# EasyEDA schematic Sheet_1(1)_ 09.12.2023.json
TITLE: Sheet_1; REV: 1.0; Date: 2023-06-13; Sheet: 1/1; Drawn By: venkatakrishnanr; Company: Your Company
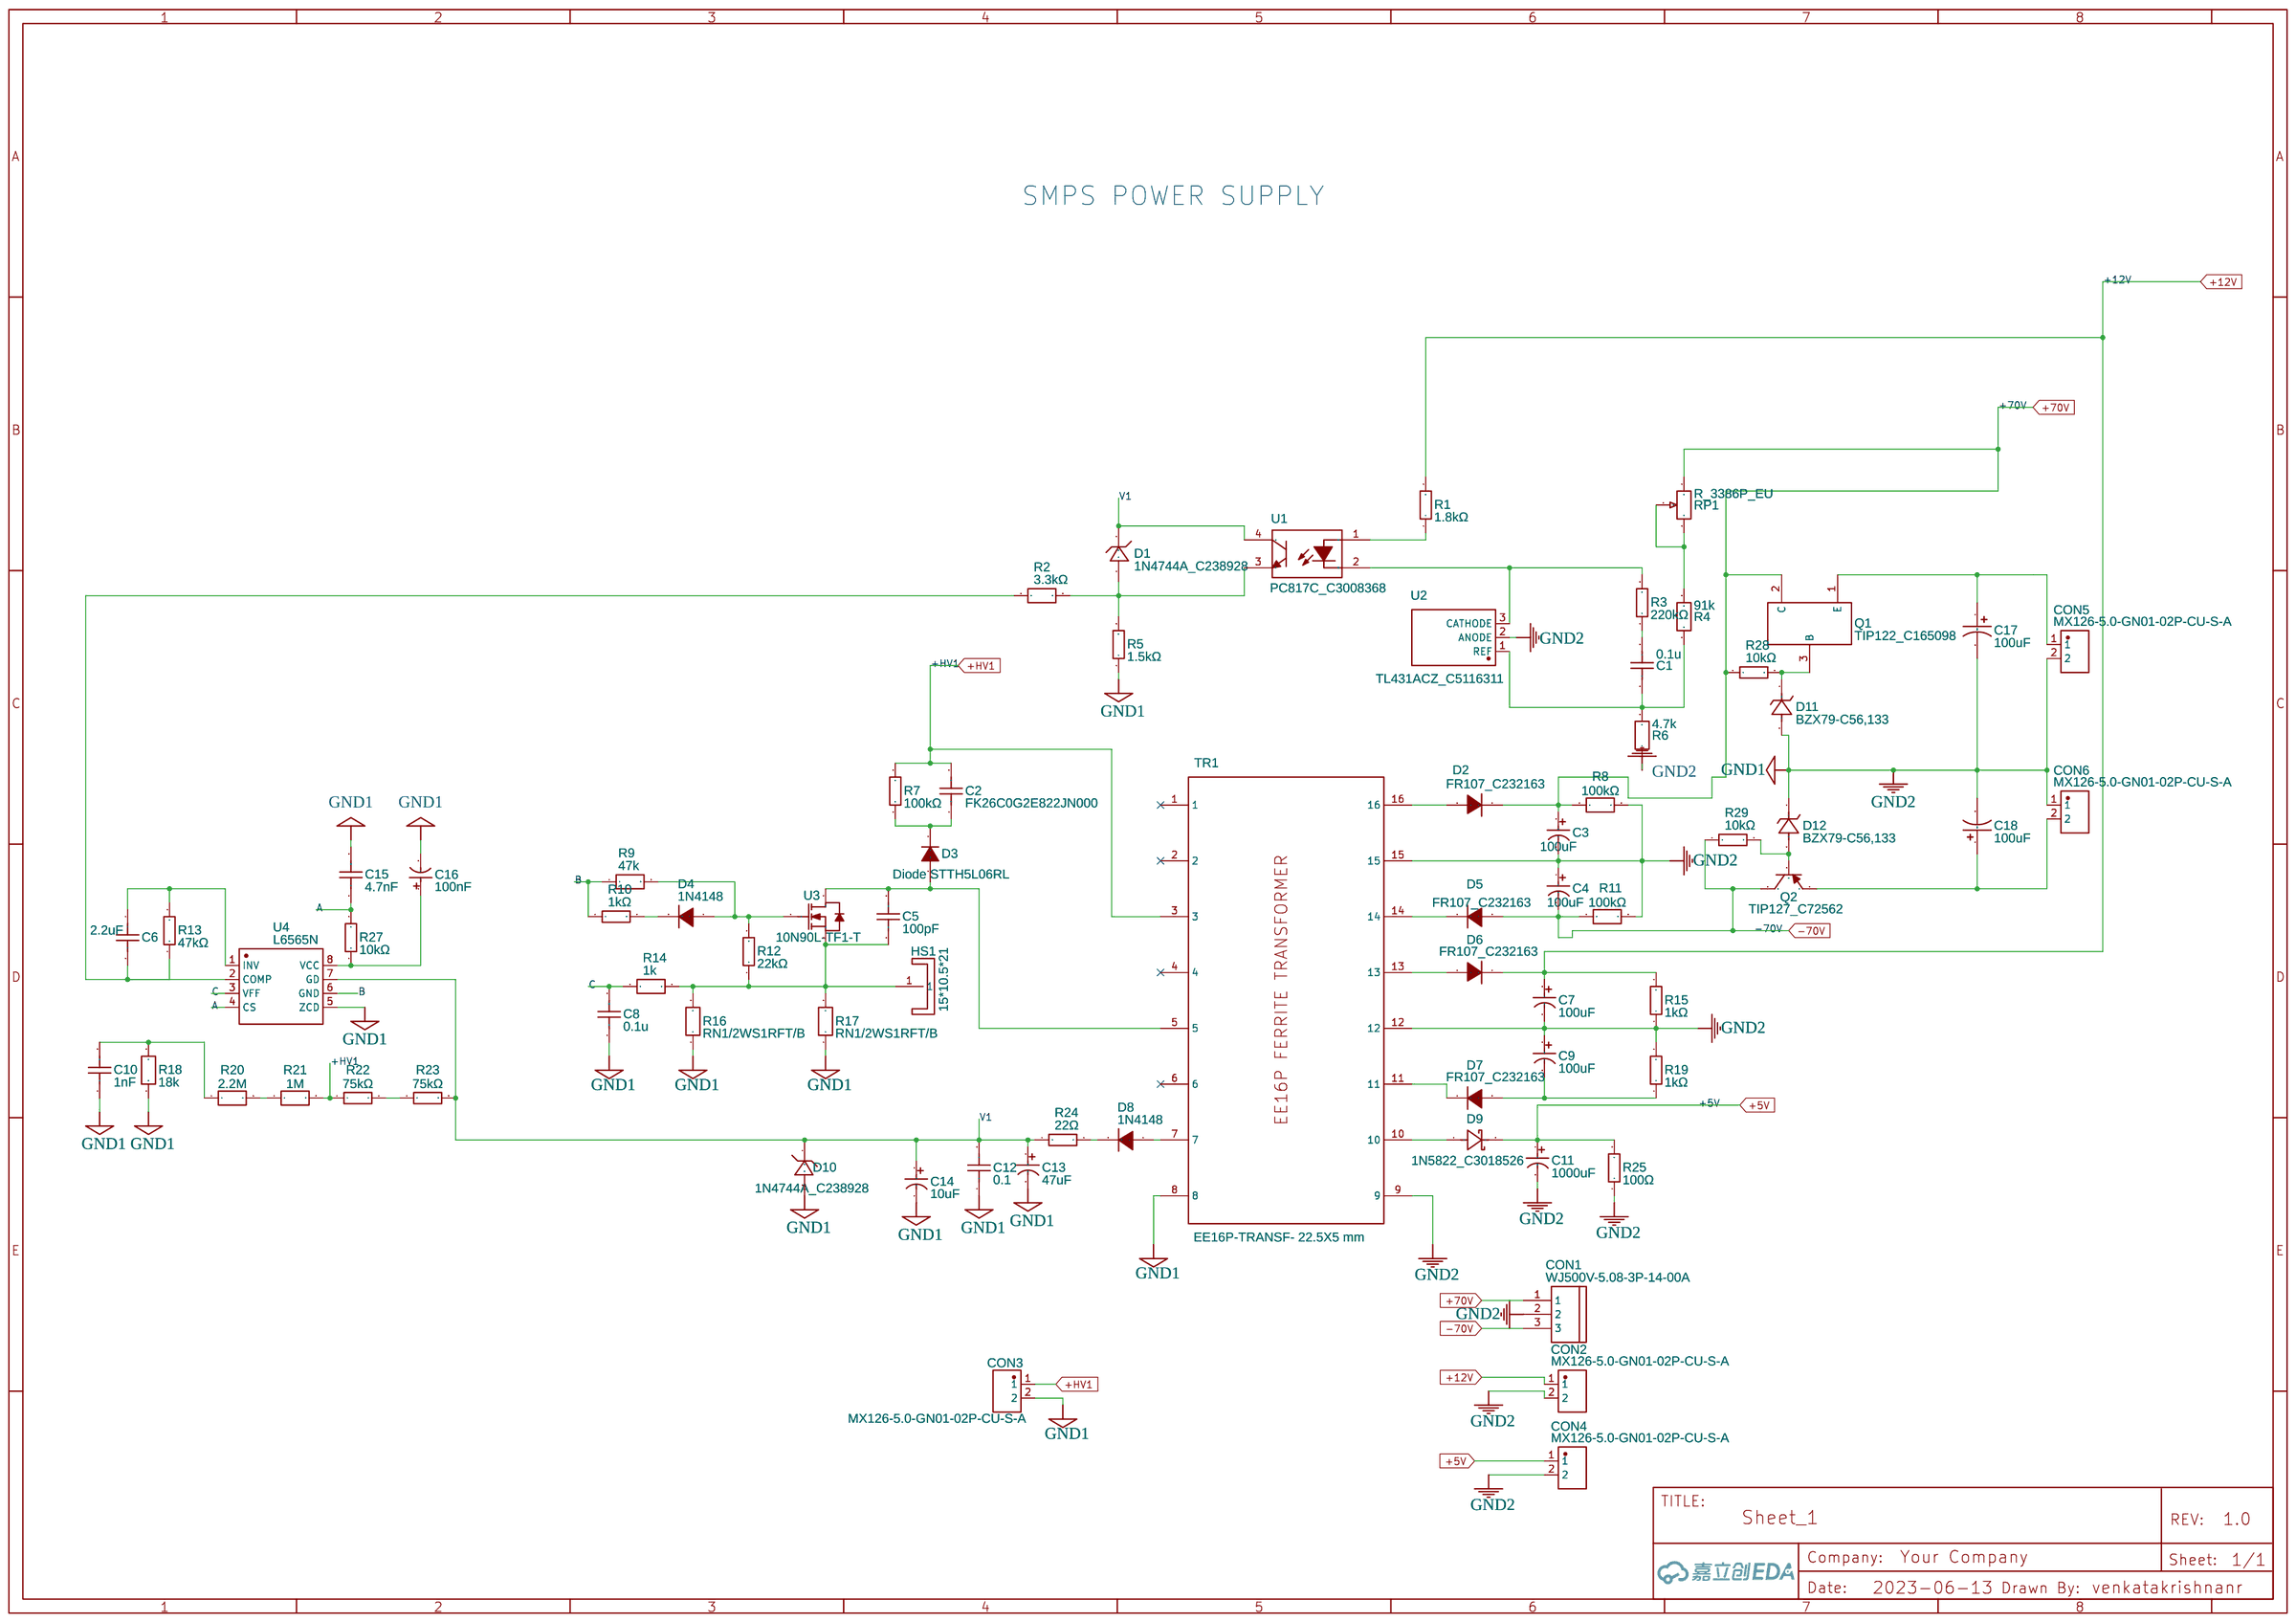
[diagram p0: schematic sheet]

## Parts
C1  0.1u  [CAP-TH_L4.5-W2.5-P5.00-D0.5]
C2  FK26C0G2E822JN000  [CAP-TH_L5.5-W3.5-P5.00-D0.5]
C3  100uF  [CAP-TH_BD10.0-P5.00-D1.0-FD]
C4  100uF  [CAP-TH_BD10.0-P5.00-D1.0-FD]
C5  100pF  [CAP-TH_L7.0-W3.0-P5.00-D0.9]
C6  2.2uF  [CAP-TH_L4.5-W2.5-P5.00-D0.5]
C7  100uF  [CAP-TH_BD6.3-P2.50-D1.0-FD]
C8  0.1u  [CAP-TH_L4.5-W2.5-P5.00-D0.5]
C9  100uF  [CAP-TH_BD6.3-P2.50-D1.0-FD]
C10  1nF  [CAP-TH_L4.5-W2.5-P5.00-D0.5]
C11  1000uF  [CAP-TH_BD10.0-P5.00-D1.0-FD]
C12  0.1  [CAP-TH_L4.5-W2.5-P5.00-D0.5]
C13  47uF  [CAP-TH_BD5.0-P2.00-D0.8-FD]
C14  10uF  [CAP-TH_BD5.0-P2.00-D0.8-FD]
C15  4.7nF  [CAP-TH_L4.2-W3.8-P5.08-D0.5]
C16  100nF  [CAP-TH_BD4.0-P1.50-D0.8-FD]
C17  100uF  [CAP-TH_BD10.0-P5.00-D0.6-FD]
C18  100uF  [CAP-TH_BD10.0-P5.00-D0.6-FD]
CON1  WJ500V-5.08-3P-14-00A  [CONN-TH_3P-P5.00_WJ500V-5.08-3P]
CON2  MX126-5.0-GN01-02P-CU-S-A  [CONN-TH_2P-P5.00_MX126-5.0-GN01-02P-CU-S-A]
CON3  MX126-5.0-GN01-02P-CU-S-A  [CONN-TH_2P-P5.00_MX126-5.0-GN01-02P-CU-S-A]
CON4  MX126-5.0-GN01-02P-CU-S-A  [CONN-TH_2P-P5.00_MX126-5.0-GN01-02P-CU-S-A]
CON5  MX126-5.0-GN01-02P-CU-S-A  [CONN-TH_2P-P5.00_MX126-5.0-GN01-02P-CU-S-A]
CON6  MX126-5.0-GN01-02P-CU-S-A  [CONN-TH_2P-P5.00_MX126-5.0-GN01-02P-CU-S-A]
D1  1N4744A_C238928  [DO-41_BD2.4-L4.7-P8.70-D0.9-RD]
D2  FR107_C232163  [DO-41_BD2.4-L4.7-P8.70-D0.9-RD]
D3  Diode STTH5L06RL  [DO-201AD_BD3.7-L8.9-P12.4-D1.20-FD]
D4  1N4148  [DO-35_BD2.0-L4.0-P8.00-D0.5-FD]
D5  FR107_C232163  [DO-41_BD2.4-L4.7-P8.70-D0.9-RD]
D6  FR107_C232163  [DO-41_BD2.4-L4.7-P8.70-D0.9-RD]
D7  FR107_C232163  [DO-41_BD2.4-L4.7-P8.70-D0.9-RD]
D8  1N4148  [DO-35_BD2.0-L4.0-P8.00-D0.5-FD]
D9  1N5822_C3018526  [DO-201AD_BD5.3-L8.4-P12.50-D1.4-FD]
D10  1N4744A_C238928  [DO-41_BD2.4-L4.7-P8.70-D0.9-RD]
D11  BZX79-C56,133  [SOD-27_BD1.9-L4.3-P8.25-D0.6-RD]
D12  BZX79-C56,133  [SOD-27_BD1.9-L4.3-P8.25-D0.6-RD]
HS1  15*10.5*21  [SINK-TH_L15.0-W10.5-H21.0]
Q1  TIP122_C165098  [TO-126_L7.8-W2.7-P2.30-L]
Q2  TIP127_C72562  [TO-126-3_L8.0-W3.0-P2.30-L]
R1  1.8kΩ  [RES-TH_BD2.2-L6.5-P10.50-D0.6]
R2  3.3kΩ  [RES-TH_BD2.4-L6.3-P10.30-D0.6]
R3  220kΩ  [RES-TH_BD2.5-L6.5-P10.50-D0.6]
R4  91k  [RES-TH_BD4.5-L11.0-P15.00-D0.6]
R5  1.5kΩ  [RES-TH_BD2.3-L6.5-P10.50-D0.5]
R6  4.7k  [RES-TH_BD2.7-L9.0-P13.00-D0.6]
R7  100kΩ  [RES-TH_BD4.5-L11.5-P15.50-D0.7]
R8  100kΩ  [RES-TH_BD4.0-L9.0-P13.00-D0.7]
R9  47k  [RES-TH_BD2.7-L9.0-P13.00-D0.6]
R10  1kΩ  [RES-TH_BD2.3-L6.5-P10.50-D0.5]
R11  100kΩ  [RES-TH_BD4.0-L9.0-P13.00-D0.7]
R12  22kΩ  [RES-TH_BD2.3-L6.5-P10.50-D0.5]
R13  47kΩ  [RES-TH_BD2.2-L6.5-P10.50-D0.6]
R14  1k  [RES-TH_BD1.7-L3.2-P7.20-D0.5]
R15  1kΩ  [RES-TH_BD2.3-L6.5-P10.50-D0.5]
R16  RN1/2WS1RFT/B  [RES-TH_BD3.5-L9.0-P13.00-D0.8]
R17  RN1/2WS1RFT/B  [RES-TH_BD3.5-L9.0-P13.00-D0.8]
R18  18k  [RES-TH_BD1.7-L3.2-P7.20-D0.5]
R19  1kΩ  [RES-TH_BD2.3-L6.5-P10.50-D0.5]
R20  2.2M  [RES-TH_BD5.0-L11.5-P15.50-D0.6]
R21  1M  [RES-TH_BD5.0-L11.5-P15.50-D0.6]
R22  75kΩ  [RES-TH_BD2.4-L6.3-P10.30-D0.6]
R23  75kΩ  [RES-TH_BD2.4-L6.3-P10.30-D0.6]
R24  22Ω  [RES-TH_BD2.4-L6.3-P10.30-D0.6]
R25  100Ω  [RES-TH_BD3.5-L9.0-P13.00-D0.5]
R27  10kΩ  [R0603]
R28  10kΩ  [RES-TH_BD4.0-L10.5-P14.50-D0.6]
R29  10kΩ  [RES-TH_BD4.0-L10.5-P14.50-D0.6]
RP1  R_3386P_EU  [RES-ADJ-TH_3386P]
TR1  EE16P-TRANSF- 22.5X5 mm  [EE16_TRANS_22.5MM_P5MM]
U1  PC817C_C3008368  [DIP-4_L4.6-W6.5-P2.54-LS7.6-BL]
U2  TL431ACZ_C5116311  [TO-92-3_L4.7-W3.7-P2.54-L]
U3  10N90L-TF1-T  [TO-220-3_L10.0-W4.6-P2.54-L]
U4  L6565N  [DIP-8_L11.0-W6.6-P2.54-LS8.9-BL]

## Library data of the parts
C1 C6 C8 C12 = C_0603_US: Contributor: LCEDA_Lib
C2 = FK26C0G2E822JN000: Supplier: LCSC; Supplier Part: C3691532; Manufacturer: TDK; Capacitance: 8.2nF; Contributor: lcsc
C3 C4 = ERS1KM101G16OT: Supplier: LCSC; Manufacturer: AISHI(艾华集团); Supplier Part: C106679; JLCPCB Part Class: Extended Part
C5 = CT81-N6Y5P1B101KSEW: Supplier: LCSC; Supplier Part: C278008; Manufacturer: FH(风华); Contributor: LCSC; JLCPCB Part Class: Extended Part
C7 C9 = ERS1VM101E12OT: Supplier: LCSC; Manufacturer: AISHI(艾华集团); Supplier Part: C106694; JLCPCB Part Class: Extended Part
C10 = C_0603_US: Contributor: LCEDA_Lib; Package Display: No
C11 = 1000uF 16V: Supplier: LCSC; Manufacturer: CX(承兴); Manufacturer Part: KM108M016G16RR0VH2FP0; Supplier Part: C43909; JLCPCB Part Class: Extended Part
C13 = 25YXF47MEFC5X11: Supplier: LCSC; Manufacturer: rubycon(红宝石); Supplier Part: C88724; JLCPCB Part Class: Extended Part
C14 = 10uF 25V 5*11: Supplier: LCSC; Manufacturer: CX(承兴); Manufacturer Part: KM106M025D11RR0VH2FP0; Supplier Part: C43347; JLCPCB Part Class: Extended Part
C15 = 05B472K500BF3C1H0R: Contributor: LCSC; Supplier: LCSC; Supplier Part: C409808; Manufacturer: STE(松田); JLCPCB Part Class: Extended Part; link: https://lcsc.com/eda_search?q=C409808&%26type=1&ref=editor
C16 = 0.1uF 50V 4*7: Supplier: LCSC; Manufacturer: CX(承兴); Manufacturer Part: KS104M050C07RR0VH2FP0; Supplier Part: C45664; JLCPCB Part Class: Extended Part; link: https://lcsc.com/eda_search?q=C45664&%26type=1&ref=editor
C17 C18 = 01EC0961: Contributor: lcsc; Supplier: LCSC; Supplier Part: C2831792; Manufacturer: KNSCHA(科尼盛); JLCPCB Part Class: Extended Part; link: https://lcsc.com/eda_search?q=C2831792&%26type=1&ref=editor
CON1 = WJ500V-5.08-3P-14-00A: Supplier: LCSC; Manufacturer: KANGNEX(康奈克斯电气); Manufacturer Part: WJ500V-5.08-3P; Supplier Part: C72334; JLCPCB Part Class: Extended Part; link: https://lcsc.com/eda_search?q=C72334&%26type=1&ref=editor
CON2-CON6 = MX126-5.0-GN01-02P-CU-S-A: Supplier: LCSC; Supplier Part: C5188434; Manufacturer: MAX(迈旭); Manufacturer Part: MX126-5.0-GN01-02P-Cu-S-A; JLCPCB Part Class: Extended Part; Contributor: lcsc; link: https://lcsc.com/eda_search?q=C5188434&%26type=1&ref=editor
D1 D10 = 1N4744A_C238928: Supplier: LCSC; Supplier Part: C238928; Manufacturer: onsemi(安森美); Manufacturer Part: 1N4744A; Contributor: LCSC; JLCPCB Part Class: Extended Part
D2 D5-D7 = FR107_C232163: Supplier: LCSC; Supplier Part: C232163; Manufacturer: GD(固锝); Manufacturer Part: FR107; Contributor: LCSC; JLCPCB Part Class: Extended Part
D3 = Diode STTH5L06RL: Manufacturer Part: STMicroelectronics NV; Contributor: peteb2; Supplier Part: 2353682; Supplier: Element14; link: https://www.farnell.com/datasheets/2308621.pdf
D4 D8 = 1N4148: Supplier: LCSC; Manufacturer: ST(先科); Supplier Part: C14516; JLCPCB Part Class: Extended Part
D9 = 1N5822_C3018526: Supplier: LCSC; Supplier Part: C3018526; Manufacturer: FUXINSEMI(富芯森美); Manufacturer Part: 1N5822; Contributor: lcsc; JLCPCB Part Class: Extended Part
D11 D12 = BZX79-C56,133: Contributor: LCSC; Supplier: LCSC; Supplier Part: C550860; Manufacturer: Nexperia(安世); JLCPCB Part Class: Extended Part; link: https://lcsc.com/eda_search?q=C550860&%26type=1&ref=editor
HS1 = 15*10.5*21: Contributor: LCSC; Supplier: LCSC; Supplier Part: C4649; Manufacturer: XSD(鑫顺达); Manufacturer Part: 15.5*10.5*21 H型散热片; JLCPCB Part Class: Extended Part; link: https://lcsc.com/eda_search?q=C4649&%26type=1&ref=editor
Q1 = TIP122_C165098: Contributor: 立创EDA官方封装库; Supplier: LCSC; Manufacturer: CJ(江苏长电/长晶); Manufacturer Part: TIP122; Supplier Part: C165098; JLCPCB Part Class: Extended Part; link: https://lcsc.com/eda_search?q=C165098&%26type=1&ref=editor
Q2 = TIP127_C72562: Contributor: LCSC; Supplier: LCSC; Supplier Part: C72562; Manufacturer: CJ(江苏长电/长晶); Manufacturer Part: TIP127; link: https://lcsc.com/eda_search?q=C72562&%26type=1&ref=editor
R1 = MF1/4W-1.8KΩ±1% T52: Contributor: LCSC; Supplier: LCSC; Supplier Part: C119329; Manufacturer: CCO(千志电子); Manufacturer Part: MF1/4W-1.8KΩ±1% T; JLCPCB Part Class: Extended Part; link: https://lcsc.com/eda_search?q=C119329&%26type=1&ref=editor
R2 = RN 1/4W 3K3 F T/B A1: Contributor: LCSC; Supplier: LCSC; Supplier Part: C410631; Manufacturer: Tyohm(幸亚电阻); JLCPCB Part Class: Extended Part; link: https://lcsc.com/eda_search?q=C410631&%26type=1&ref=editor
R3 = MO1/2WS-220K±5%-ST52: Contributor: LCSC; Supplier: LCSC; Supplier Part: C479385; Manufacturer: VO(翔胜); JLCPCB Part Class: Extended Part; link: https://lcsc.com/eda_search?q=C479385&%26type=1&ref=editor
R4 R6 R9 R14 R18 R20 R21 = R_0603_EU: Contributor: LCEDA_Lib
R5 = MF1/4W-1.5KΩ±1% T52: Contributor: LCSC; Supplier: LCSC; Supplier Part: C119328; Manufacturer: CCO(千志电子); Manufacturer Part: MF1/4W-1.5KΩ±1% T; JLCPCB Part Class: Extended Part; link: https://lcsc.com/eda_search?q=C119328&%26type=1&ref=editor
R7 = MF1W-100KΩ±1% T: Supplier: LCSC; Supplier Part: C119512; Manufacturer: CCO(千志电子); Resistance (Ohms): 100K; Contributor: LCSC; JLCPCB Part Class: Extended Part
R8 R11 = VR37000001003FA100: Supplier: LCSC; Supplier Part: C1365486; Manufacturer: VISHAY(威世); link: https://atta.szlcsc.com/upload/public/pdf/source/20210505/3FF10F60F8DC2A1CEC4A1E7A3169512D.pdf; JLCPCB Part Class: Extended Part; Contributor: lcsc
R10 R15 R19 = MF1/4W-1KΩ±1% T52: Contributor: LCSC; Supplier: LCSC; Supplier Part: C119324; Manufacturer: CCO(千志电子); Manufacturer Part: MF1/4W-1KΩ±1% T; JLCPCB Part Class: Extended Part; link: https://lcsc.com/eda_search?q=C119324&%26type=1&ref=editor
R12 = MF1/4W-22KΩ±1% T52: Contributor: LCSC; Supplier: LCSC; Supplier Part: C119354; Manufacturer: CCO(千志电子); Manufacturer Part: MF1/4W-22KΩ±1% T; JLCPCB Part Class: Extended Part; link: https://lcsc.com/eda_search?q=C119354&%26type=1&ref=editor
R13 = MF1/4W-47KΩ±1% T52: Contributor: LCSC; Supplier: LCSC; Supplier Part: C119362; Manufacturer: CCO(千志电子); Manufacturer Part: MF1/4W-47KΩ±1% T; JLCPCB Part Class: Extended Part; link: https://lcsc.com/eda_search?q=C119362&%26type=1&ref=editor
R16 R17 = RN1/2WS1RFT/B: Supplier: LCSC; Supplier Part: C5200406; Manufacturer: Tyohm(幸亚电阻); link: https://atta.szlcsc.com/upload/public/pdf/source/20221031/68CFB238B7BB4A827FA9BFFB893F20CD.pdf; Resistance: 1Ω; Contributor: lcsc
R22 R23 = MFR-25JT-52-75K: Contributor: LCSC; Supplier: LCSC; Supplier Part: C176543; Manufacturer: YAGEO(国巨); JLCPCB Part Class: Extended Part; link: https://lcsc.com/eda_search?q=C176543&%26type=1&ref=editor
R24 = MFR-25FTE52-22R: Contributor: LCSC; Supplier: LCSC; Supplier Part: C172987; Manufacturer: YAGEO(国巨); JLCPCB Part Class: Extended Part; link: https://lcsc.com/eda_search?q=C172987&%26type=1&ref=editor
R25 = KNP1WS-100Ω±5%-XT52: Supplier: LCSC; Supplier Part: C479229; Manufacturer: VO(翔胜); Contributor: LCSC; JLCPCB Part Class: Extended Part
R27 = RC0603FR-0710KL: Supplier: LCSC; Manufacturer: YAGEO(国巨); Supplier Part: C98220; JLCPCB Part Class: Extended Part; link: https://lcsc.com/eda_search?q=C98220&%26type=1&ref=editor
R28 R29 = RD50T5103J: Contributor: LCSC; Supplier: LCSC; Supplier Part: C167530; Manufacturer: 大毅科技; JLCPCB Part Class: Extended Part; link: https://lcsc.com/eda_search?q=C167530&%26type=1&ref=editor
RP1 = R_3386P_EU: Supplier: LCSC; Contributor: LCEDA_Lib; Value(Ω): 100k
TR1 = EE16P-TRANSF- 22.5X5 mm: Supplier Part: EE 16; link: https://www.tdk-electronics.tdk.com/inf/80/db/fer/e_16_8_5.pdf; Contributor: venkatakrishnanr
U1 = PC817C_C3008368: Supplier: LCSC; Supplier Part: C3008368; Manufacturer: UMW(广东友台半导体); Manufacturer Part: PC817C; link: https://atta.szlcsc.com/upload/public/pdf/source/20220426/2390BA52A41E87A0EACD5DD600D9CD8B.pdf; Contributor: lcsc; JLCPCB Part Class: Extended Part
U2 = TL431ACZ_C5116311: Supplier: LCSC; Supplier Part: C5116311; Manufacturer: HGSEMI(华冠); Manufacturer Part: TL431ACZ; link: https://atta.szlcsc.com/upload/public/pdf/source/20221108/41FB555FEE59409ACADEB25B8A84C53E.pdf; Contributor: lcsc; JLCPCB Part Class: Extended Part
U3 = 10N90L-TF1-T: Supplier: LCSC; Supplier Part: C5310392; Manufacturer: UTC(友顺); link: https://atta.szlcsc.com/upload/public/pdf/source/20221209/E1B4F3C8BB51032E269594BD39724919.pdf; Contributor: lcsc
U4 = L6565N: Supplier: LCSC; Manufacturer: ST(意法半导体); Supplier Part: C31140; JLCPCB Part Class: Extended Part

## Nets
+5V: C11.1 CON4.1 D9.2(K) R25.2
+12V: C7.1 CON2.1 D6.1(C) R1.2 R15.2
+70V: C3.1 CON1.1 D2.1(C) Q1.2(C) R8.1 R28.1 RP1.1
-70V: C4.2 CON1.3 D5.2(A) Q2.2(C) R11.1 R29.1
GND1: C3.2 C4.1 C7.2 C8.1 C9.1 C10.1 C11.2 C12.1 C13.2 C14.2 C15.2 C16.2 C17.2 C18.2 CON1.2 CON2.2 CON3.2 CON4.2 CON5.2 CON6.1 D10.2 D11.2(A) D12.1(K) R5.1 R6.1 R8.2 R11.2 R15.1 R16.1 R17.1 R18.1 R19.2 R25.1 TR1.8 TR1.9 TR1.12 TR1.15 U2.2(ANODE) U4.5(ZCD)
V1: C12.2 C13.1 C14.1 D1.1 D10.1 R23.2 R24.1 U1.4(COL) U4.7(GD)
+HV1: C2.2 CON3.1 R7.2 R21.2 R22.1 TR1.3
A: C15.1 R27.2 U4.4(CS)
B: R9.1 R10.1 U4.6(GND)
C: C8.2 R14.1 U4.3(VFF)
Net-(C1-1): C1.1 R4.1 R6.2 U2.1(REF)
Net-(C1-2): C1.2 R3.1
Net-(C2-1): C2.1 D3.2(K) R7.1
Net-(C5-1): C5.1 HS1.1 R12.1 R14.2 R16.2 R17.2 U3.3(S)
Net-(C5-2): C5.2 D3.1(A) TR1.5 U3.2(D)
Net-(C6-1): C6.1 R13.2 U4.1(INV)
Net-(C6-2): C6.2 R2.1 R13.1 U4.2(COMP)
Net-(C9-2): C9.2 D7.2(A) R19.1
Net-(C10-2): C10.2 R18.2 R20.1
Net-(C16-1): C16.1 R27.1 U4.8(VCC)
Net-(C17-1): C17.1 CON5.1 Q1.1(E)
Net-(C18-1): C18.1 CON6.2 Q2.1(E)
Net-(D1-2): D1.2 R2.2 R5.2 U1.3(EM)
Net-(D2-2): D2.2(A) TR1.16
Net-(D4-1): D4.1(A) R9.2 R12.2 U3.1(G)
Net-(D4-2): D4.2(C) R10.2
Net-(D5-1): D5.1(C) TR1.14
Net-(D6-2): D6.2(A) TR1.13
Net-(D7-1): D7.1(C) TR1.11
Net-(D8-1): D8.1(A) TR1.7
Net-(D8-2): D8.2(C) R24.2
Net-(D9-1): D9.1(A) TR1.10
Net-(D11-1): D11.1(K) Q1.3(B) R28.2
Net-(D12-2): D12.2(A) Q2.3(B) R29.2
Net-(R1-1): R1.1 U1.1(AN)
Net-(R3-2): R3.2 U1.2(CAT) U2.3(CATHODE)
Net-(R4-2): R4.2 RP1.2 RP1.3
Net-(R20-2): R20.2 R21.1
Net-(R22-2): R22.2 R23.1

Not connected (* = marked no-connect by the designer): TR1 1* 2* 4* 6*

## Notes on the sheet
- SMPS POWER SUPPLY
